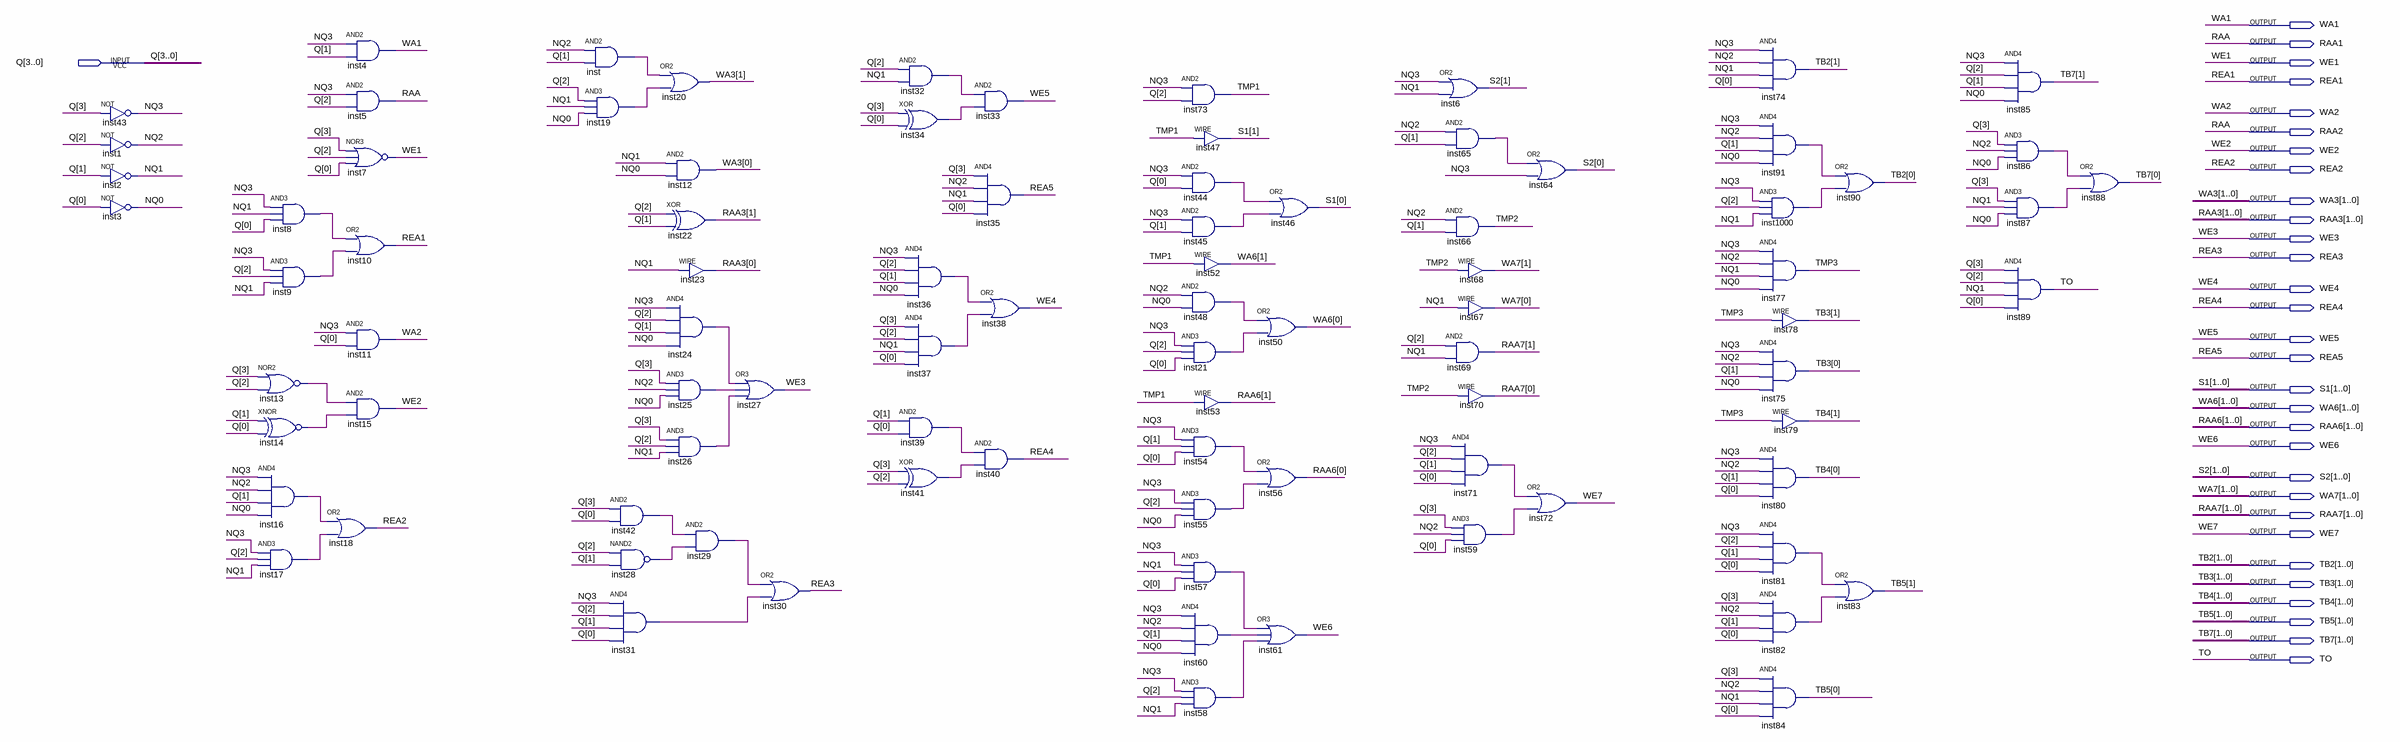
[diagram p0: schematic sheet]
// Quartus schematic OutputBlock.bdf as structural Verilog: 88 symbols, 31 pins
module OutputBlock (
  input  [3:0] Q,
  output WA1,
  output RAA1,
  output WE1,
  output REA1,
  output WA2,
  output RAA2,
  output WE2,
  output REA2,
  output [1:0] WA3,
  output [1:0] RAA3,
  output WE3,
  output REA3,
  output WE4,
  output REA4,
  output WE5,
  output REA5,
  output [1:0] S1,
  output [1:0] WA6,
  output [1:0] RAA6,
  output WE6,
  output [1:0] S2,
  output [1:0] WA7,
  output [1:0] RAA7,
  output WE7,
  output [1:0] TB2,
  output [1:0] TB3,
  output [1:0] TB4,
  output [1:0] TB5,
  output [1:0] TB7,
  output TO
);

  wire inst8_out, inst9_out, inst13_out, inst14_out, inst16_out, inst17_out, inst19_out, inst21_out,
       inst24_out, inst25_out, inst26_out, inst28_out, inst29_out, inst31_out, inst32_out, inst34_out,
       inst36_out, inst37_out, inst39_out, inst41_out, inst42_out, inst44_out, inst45_out, inst48_out,
       inst54_out, inst55_out, inst57_out, inst58_out, inst59_out, inst60_out, inst65_out, inst71_out,
       inst81_out, inst82_out, inst86_out, inst87_out, inst91_out, inst1000_out, inst_out, NQ0, NQ1, NQ2,
       NQ3, TMP1, TMP2, TMP3;

  not inst43 (NQ3, Q[3]);
  not inst1 (NQ2, Q[2]);
  not inst2 (NQ1, Q[1]);
  not inst3 (NQ0, Q[0]);
  and inst8 (inst8_out, NQ3, NQ1, Q[0]);
  and inst9 (inst9_out, NQ3, Q[2], NQ1);
  nor inst13 (inst13_out, Q[3], Q[2]);
  xnor inst14 (inst14_out, Q[1], Q[0]);
  and inst16 (inst16_out, NQ3, NQ2, Q[1], NQ0);
  and inst17 (inst17_out, NQ3, Q[2], NQ1);
  and inst4 (WA1, NQ3, Q[1]);
  and inst5 (RAA1, NQ3, Q[2]);
  nor inst7 (WE1, Q[3], Q[2], Q[0]);
  or inst10 (REA1, inst8_out, inst9_out);
  and inst11 (WA2, NQ3, Q[0]);
  and inst15 (WE2, inst13_out, inst14_out);
  or inst18 (REA2, inst16_out, inst17_out);
  and inst (inst_out, NQ2, Q[1]);
  and inst19 (inst19_out, Q[2], NQ1, NQ0);
  and inst42 (inst42_out, Q[3], Q[0]);
  nand inst28 (inst28_out, Q[2], Q[1]);
  and inst31 (inst31_out, NQ3, Q[2], Q[1], Q[0]);
  or inst20 (WA3[1], inst_out, inst19_out);
  and inst12 (WA3[0], NQ1, NQ0);
  xor inst22 (RAA3[1], Q[2], Q[1]);
  and inst24 (inst24_out, NQ3, Q[2], Q[1], NQ0);
  and inst25 (inst25_out, Q[3], NQ2, NQ0);
  and inst26 (inst26_out, Q[3], Q[2], NQ1);
  assign RAA3[0] = NQ1;  // WIRE inst23
  and inst29 (inst29_out, inst42_out, inst28_out);
  or inst27 (WE3, inst24_out, inst25_out, inst26_out);
  or inst30 (REA3, inst29_out, inst31_out);
  and inst32 (inst32_out, Q[2], NQ1);
  xor inst34 (inst34_out, Q[3], Q[0]);
  and inst36 (inst36_out, NQ3, Q[2], Q[1], NQ0);
  and inst37 (inst37_out, Q[3], Q[2], NQ1, Q[0]);
  and inst39 (inst39_out, Q[1], Q[0]);
  xor inst41 (inst41_out, Q[3], Q[2]);
  and inst33 (WE5, inst32_out, inst34_out);
  and inst35 (REA5, Q[3], NQ2, NQ1, Q[0]);
  and inst40 (REA4, inst39_out, inst41_out);
  or inst38 (WE4, inst36_out, inst37_out);
  and inst73 (TMP1, NQ3, Q[2]);
  assign S1[1] = TMP1;  // WIRE inst47
  and inst44 (inst44_out, NQ3, Q[0]);
  and inst45 (inst45_out, NQ3, Q[1]);
  assign WA6[1] = TMP1;  // WIRE inst52
  and inst48 (inst48_out, NQ2, NQ0);
  and inst21 (inst21_out, NQ3, Q[2], Q[0]);
  assign RAA6[1] = TMP1;  // WIRE inst53
  and inst54 (inst54_out, NQ3, Q[1], Q[0]);
  and inst55 (inst55_out, NQ3, Q[2], NQ0);
  and inst57 (inst57_out, NQ3, NQ1, Q[0]);
  and inst60 (inst60_out, NQ3, NQ2, Q[1], NQ0);
  and inst58 (inst58_out, NQ3, Q[2], NQ1);
  or inst46 (S1[0], inst44_out, inst45_out);
  or inst50 (WA6[0], inst48_out, inst21_out);
  or inst56 (RAA6[0], inst54_out, inst55_out);
  or inst61 (WE6, inst57_out, inst60_out, inst58_out);
  or inst6 (S2[1], NQ3, NQ1);
  and inst65 (inst65_out, NQ2, Q[1]);
  and inst66 (TMP2, NQ2, Q[1]);
  assign WA7[1] = TMP2;  // WIRE inst68
  assign WA7[0] = NQ1;  // WIRE inst67
  and inst69 (RAA7[1], Q[2], NQ1);
  assign RAA7[0] = TMP2;  // WIRE inst70
  and inst71 (inst71_out, NQ3, Q[2], Q[1], Q[0]);
  and inst59 (inst59_out, Q[3], NQ2, Q[0]);
  or inst64 (S2[0], inst65_out, NQ3);
  or inst72 (WE7, inst71_out, inst59_out);
  and inst74 (TB2[1], NQ3, NQ2, NQ1, Q[0]);
  and inst91 (inst91_out, NQ3, NQ2, Q[1], NQ0);
  and inst1000 (inst1000_out, NQ3, Q[2], NQ1);
  and inst77 (TMP3, NQ3, NQ2, NQ1, NQ0);
  assign TB3[1] = TMP3;  // WIRE inst78
  and inst75 (TB3[0], NQ3, NQ2, Q[1], NQ0);
  assign TB4[1] = TMP3;  // WIRE inst79
  and inst80 (TB4[0], NQ3, NQ2, Q[1], Q[0]);
  and inst81 (inst81_out, NQ3, Q[2], Q[1], Q[0]);
  and inst82 (inst82_out, Q[3], NQ2, Q[1], Q[0]);
  and inst84 (TB5[0], Q[3], NQ2, NQ1, Q[0]);
  or inst90 (TB2[0], inst91_out, inst1000_out);
  or inst83 (TB5[1], inst81_out, inst82_out);
  and inst85 (TB7[1], NQ3, Q[2], Q[1], NQ0);
  and inst86 (inst86_out, Q[3], NQ2, NQ0);
  and inst87 (inst87_out, Q[3], NQ1, NQ0);
  and inst89 (TO, Q[3], Q[2], NQ1, Q[0]);
  or inst88 (TB7[0], inst86_out, inst87_out);

  assign RAA2 = RAA1;

  // Other names for the same wires on the sheet: RAA = RAA1
endmodule
